# Altium project LM2587_DC-DC_Boost_Converter.PrjPcb
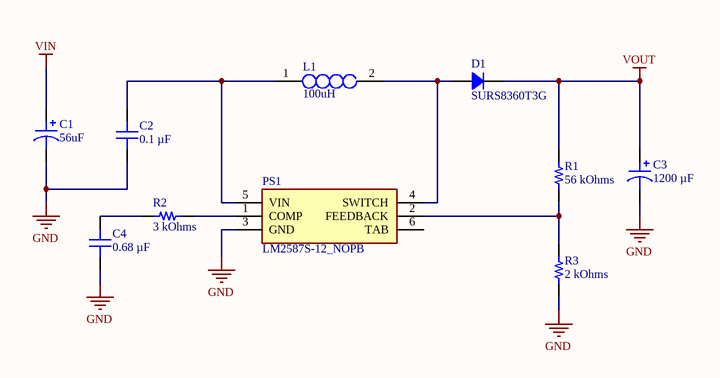
[diagram p0: LM2587.SchDoc]
1 sheet, 10 parts. Net scope: global (net labels, ports and power ports of the same name join across sheets).
Board file: LM2587.PcbDoc

## Sheet LM2587.SchDoc
size A4; SheetNumber: 1; SheetTotal: 1

### Parts
C1  56uF  [CAP ALSMD 8.3MM H10.5MM]
C2  0.1 µF  [CAP 0805_2012]
C3  1200 µF  [CAP ALSMD 8.3MM H10.5MM]
C4  0.68 µF  [CAP 0805_2012]
D1  SURS8360T3G  [DO214AB SMC]
L1  100uH  [2100LL1R0VRC]
PS1  LM2587S-12_NOPB  [KTT0005B]
R1  56 kOhms  [RES 0805_2012]
R2  3 kOhms  [RES 0805_2012]
R3  2 kOhms  [RES 0805_2012]

### Nets
GND: C1.2 C2.1 C3.2 C4.1 PS1.3(GND) R3.1
VIN: C1.1
VOUT: C3.1 D1.2 R1.2
NetC2_2: C2.2 L1.1 PS1.5(VIN)
NetC4_2: C4.2 R2.1
NetD1_1: D1.1 L1.2 PS1.4(SWITCH)
NetPS1_1: PS1.1(COMP) R2.2
NetPS1_2: PS1.2(FEEDBACK) R1.1 R3.2

Not connected (* = marked no-connect by the designer): PS1 6(TAB)

### Library data of the parts
C1 = 6.3TPV1200M8X10.5: CAP ALUM 1200UF 20% 6.3V SMD; manufacturer: Rubycon; Capacitance: 1200 µF; ESR (Equivalent Series Resistance): 80mOhm @ 100kHz; Lifetime @ Temp.: 2000 Hrs @ 105°C; Polarization: Polar; Ripple Current @ High Frequency: 850 mA @ 100 kHz; Ripple Current @ Low Frequency: 510 mA @ 120 Hz; Surface Mount Land Size: 0.327" L x 0.327" W (8.30mm x 8.30mm); value: 1200 µF; Part Number: 6.3TPV1200M8X10.5; Applications: Automotive; componentlink1description: Datasheet; componentlink1url: https://www.rubycon.co.jp/wp-content/uploads/catalog-aluminum/TPV.pdf; componentlink2description: DigiKey Link; componentlink2url: https://www.digikey.com/en/products/detail/rubycon/6-3TPV1200M8X10-5/15667730; Height - Seated (Max): 0.413" (10.50mm); lastupdated: 3.02.2024 21:45:22; Lifecycle Status: Active; Minimum Order: 1; Mounting Type: Surface Mount; Operating Temperature: -55°C ~ 105°C; packaging: Bulk; partid: 27638; Part Status: Active; price: 0.35; Ratings: AEC-Q200; series: TPV; Size / Dimension: 0.315" Dia (8.00mm); Supplier 1: DigiKey; Supplier Part Number 1: 1189-6.3TPV1200M8X10.5-ND; Tolerance: ±20%; Voltage - Rated: 6.3 V
C2 = CC0805MRX7R9BB104: CAP CER 0.1UF 50V X7R 0805; manufacturer: Yageo; Tolerance: ±20%; Part Number: CC0805MRX7R9BB104; Value: 0.1 µF; Applications: General Purpose; Capacitance: 0.1 µF; componentlink1description: Datasheet; componentlink1url: https://www.yageo.com/upload/media/product/productsearch/datasheet/mlcc/UPY-GPHC_X7R_6.3V-to-50V_18.pdf; componentlink2description: DigiKey Link; componentlink2url: https://www.digikey.com/en/products/detail/yageo/CC0805MRX7R9BB104/5884281; Device Package: 0805 (2012 Metric); lastupdated: 3.02.2024 20:15:50; Lifecycle Status: Active; Minimum Order: 1; Mounting Type: Surface Mount, MLCC; Operating Temperature: -55°C ~ 125°C; Package / Case: 0805 (2012 Metric); packaging: TapeAndReel; partid: 2475; Part Status: Active; price: 0.01; series: CC; Size / Dimension: 0.079" L x 0.049" W (2.00mm x 1.25mm); Supplier 1: DigiKey; Supplier Part Number 1: 311-4351-1-ND; Temperature Coefficient: X7R; Thickness (Max): 0.037" (0.95mm); Voltage - Rated: 50V
C3 = 6.3TPV1200M8X10.5: CAP ALUM 1200UF 20% 6.3V SMD; manufacturer: Rubycon; ESR (Equivalent Series Resistance): 80mOhm @ 100kHz; Lifetime @ Temp.: 2000 Hrs @ 105°C; Polarization: Polar; Ripple Current @ High Frequency: 850 mA @ 100 kHz; Ripple Current @ Low Frequency: 510 mA @ 120 Hz; Surface Mount Land Size: 0.327" L x 0.327" W (8.30mm x 8.30mm); Part Number: 6.3TPV1200M8X10.5; Applications: Automotive; Capacitance: 1200 µF; componentlink1description: Datasheet; componentlink1url: https://www.rubycon.co.jp/wp-content/uploads/catalog-aluminum/TPV.pdf; componentlink2description: DigiKey Link; componentlink2url: https://www.digikey.com/en/products/detail/rubycon/6-3TPV1200M8X10-5/15667730; Height - Seated (Max): 0.413" (10.50mm); lastupdated: 3.02.2024 21:45:22; Lifecycle Status: Active; Minimum Order: 1; Mounting Type: Surface Mount; Operating Temperature: -55°C ~ 105°C; packaging: Bulk; partid: 27638; Part Status: Active; price: 0.35; Ratings: AEC-Q200; series: TPV; Size / Dimension: 0.315" Dia (8.00mm); Supplier 1: DigiKey; Supplier Part Number 1: 1189-6.3TPV1200M8X10.5-ND; Tolerance: ±20%; value: 1200 µF; Voltage - Rated: 6.3 V
C4 = CGA4J3X7R1H684K125AB: CAP CER 0.68UF 50V X7R 0805; manufacturer: TDK Corporation; Tolerance: ±10%; Part Number: CGA4J3X7R1H684K125AB; Value: 0.68 µF; Applications: Automotive; Capacitance: 0.68 µF; componentlink1description: Datasheet; componentlink1url: https://product.tdk.com/info/en/catalog/datasheets/mlcc_automotive_general_en.pdf?ref_disty=digikey; componentlink2description: DigiKey Link; componentlink2url: https://www.digikey.com/en/products/detail/tdk-corporation/CGA4J3X7R1H684K125AB/2672853; Device Package: 0805 (2012 Metric); lastupdated: 3.02.2024 20:15:21; Lifecycle Status: Active; Minimum Order: 1; Mounting Type: Surface Mount, MLCC; Operating Temperature: -55°C ~ 125°C; Package / Case: 0805 (2012 Metric); packaging: TapeAndReel; partid: 13295; Part Status: Active; price: 0.07; Ratings: AEC-Q200; series: CGA; Size / Dimension: 0.079" L x 0.049" W (2.00mm x 1.25mm); Supplier 1: DigiKey; Supplier Part Number 1: 445-6960-1-ND; Temperature Coefficient: X7R; Thickness (Max): 0.057" (1.45mm); Voltage - Rated: 50V
D1 = SURS8360T3G: DIODE GEN PURP 600V 3A SMC; Manufacturer: ON Semiconductor; Current - Reverse Leakage @ Vr: 10µA @ 600V; Diode Type: Standard; Reverse Recovery Time (trr): 75ns; Speed: Fast Recovery =< 500ns, > 200mA (Io); Voltage - Forward (Vf) (Max) @ If: 1.25V @ 3A; Part Number: SURS8360T3G; ComponentLink1Description: Datasheet; ComponentLink1URL: http://www.onsemi.com/pub/Collateral/MURS320T3-D.PDF; ComponentLink2Description: DigiKey Link; ComponentLink2URL: http://digikey.com/product-detail/en/on-semiconductor/SURS8360T3G/SURS8360T3GOSCT-ND/9087771; Current - Average Rectified (Io): 3A; LastUpdated: 3.02.2024 21:24:30; Lifecycle Status: Active; Minimum Order: 1; Mounting Type: Surface Mount; Operating Temperature - Junction: -65°C ~ 175°C; Package / Case: DO-214AB, SMC; Packaging: TapeAndReel; PartId: 348; Part Status: Active; Price: 0.30; Series: -; Supplier 1: DigiKey; Supplier Part Number 1: SURS8360T3GOSCT-ND; Supplier Device Package: SMC; Voltage - DC Reverse (Vr) (Max): 600V
L1 = 2100LL-1R0-V-RC: Inductor; Manufacturer_Name: Bourns; Datasheet Link: https://componentsearchengine.com/Datasheets/1/2100LL-1R0-V-RC.pdf; Height: 21.844mm; Manufacturer_Part_Number: 2100LL-1R0-V-RC; Mouser Part Number: 652-2100LL-1R0-V-RC; Mouser Price/Stock: https://www.mouser.com/Search/Refine.aspx?Keyword=652-2100LL-1R0-V-RC
PS1 = LM2587S-12_NOPB: Power Supply; Manufacturer_Name: Texas Instruments; Manufacturer_Part_Number: LM2587S-12/NOPB; Description: Texas Instruments LM2587S-12/NOPB; Datasheet Link: http://www.ti.com/lit/gpn/lm2587; Mouser Part Number: 926-LM2587S-12/NOPB; Mouser Price/Stock: https://www.mouser.co.uk/ProductDetail/Texas-Instruments/LM2587S-12-NOPB?qs=X1J7HmVL2ZFFt1BOlhawsg%3D%3D; Arrow Part Number: LM2587S-12/NOPB; Arrow Price/Stock: https://www.arrow.com/en/products/lm2587s-12nopb/texas-instruments?region=nac
R1 = RMCF0805FT56K0: RES 56K OHM 1% 1/8W 0805; Manufacturer: Stackpole Electronics Inc; Power (Watts): 0.125W, 1/8W; Temperature Coefficient: ±100ppm/°C; Part Number: RMCF0805FT56K0; Value: 56 kOhms; ComponentLink1Description: Datasheet; ComponentLink1URL: https://www.seielect.com/catalog/sei-packaging.pdf; ComponentLink2Description: DigiKey Link; ComponentLink2URL: https://www.digikey.com/en/products/detail/stackpole-electronics-inc/RMCF0805FT56K0/1760366; Composition: Thick Film; Device Package: 0805 (2012 Metric); Features: Automotive AEC-Q200; Height - Seated (Max): 0.026" (0.65mm); LastUpdated: 3.02.2024 20:59:24; Lifecycle Status: Active; Minimum Order: 1; Number of Terminations: 2; Operating Temperature: -55°C ~ 155°C; Package / Case: 0805 (2012 Metric); Packaging: CutTape; PartId: 32591; Part Status: Active; Price: 0.01; Ratings: AEC-Q200; Resistance: 56 kOhms; Series: RMCF; Size / Dimension: 0.079" L x 0.049" W (2.00mm x 1.25mm); Supplier 1: DigiKey; Supplier Part Number 1: RMCF0805FT56K0CT-ND; Supplier Device Package: 0805; Tolerance: ±1%
R2 = ERJ-6ENF3001V: RES SMD 3K OHM 1% 1/8W 0805; Manufacturer: Panasonic Electronic Components; Power (Watts): 0.125W, 1/8W; Temperature Coefficient: ±100ppm/°C; Part Number: ERJ-6ENF3001V; Value: 3 kOhms; ComponentLink1Description: Datasheet; ComponentLink1URL: https://industrial.panasonic.com/cdbs/www-data/pdf/RDA0000/AOA0000C304.pdf; ComponentLink2Description: DigiKey Link; ComponentLink2URL: https://www.digikey.com/en/products/detail/panasonic-electronic-components/ERJ-6ENF3001V/366038; Composition: Thick Film; Device Package: 0805 (2012 Metric); Features: Automotive AEC-Q200; Height - Seated (Max): 0.028" (0.70mm); LastUpdated: 3.02.2024 20:59:34; Lifecycle Status: Active; Minimum Order: 1; Number of Terminations: 2; Operating Temperature: -55°C ~ 155°C; Package / Case: 0805 (2012 Metric); Packaging: TapeAndReel; PartId: 30109; Part Status: Active; Price: 0.01; Ratings: AEC-Q200; Resistance: 3 kOhms; Series: ERJ-6EN; Size / Dimension: 0.079" L x 0.049" W (2.00mm x 1.25mm); Supplier 1: DigiKey; Supplier Part Number 1: P3.0KCCT-ND; Supplier Device Package: 0805; Tolerance: ±1%
R3 = RCS08052K00FKEA: RES SMD 2K OHM 1% 1/2W 0805; Manufacturer: Vishay Dale; Power (Watts): 0.5W, 1/2W; Temperature Coefficient: ±100ppm/°C; Part Number: RCS08052K00FKEA; Value: 2 kOhms; ComponentLink1Description: Datasheet; ComponentLink1URL: http://www.vishay.com/docs/20065/rcse3.pdf; ComponentLink2Description: DigiKey Link; ComponentLink2URL: https://www.digikey.com/en/products/detail/vishay-dale/RCS08052K00FKEA/5866986; Composition: Thick Film; Device Package: 0805 (2012 Metric); Features: Automotive AEC-Q200, Pulse Withstanding; Height - Seated (Max): 0.020" (0.50mm); LastUpdated: 3.02.2024 20:59:44; Lifecycle Status: Active; Minimum Order: 1; Number of Terminations: 2; Operating Temperature: -55°C ~ 155°C; Package / Case: 0805 (2012 Metric); Packaging: TapeAndReel; PartId: 27786; Part Status: Active; Price: 0.02; Ratings: AEC-Q200; Resistance: 2 kOhms; Series: RCS e3; Size / Dimension: 0.079" L x 0.049" W (2.00mm x 1.25mm); Supplier 1: DigiKey; Supplier Part Number 1: 541-2840-1-ND; Supplier Device Package: 0805; Tolerance: ±1%